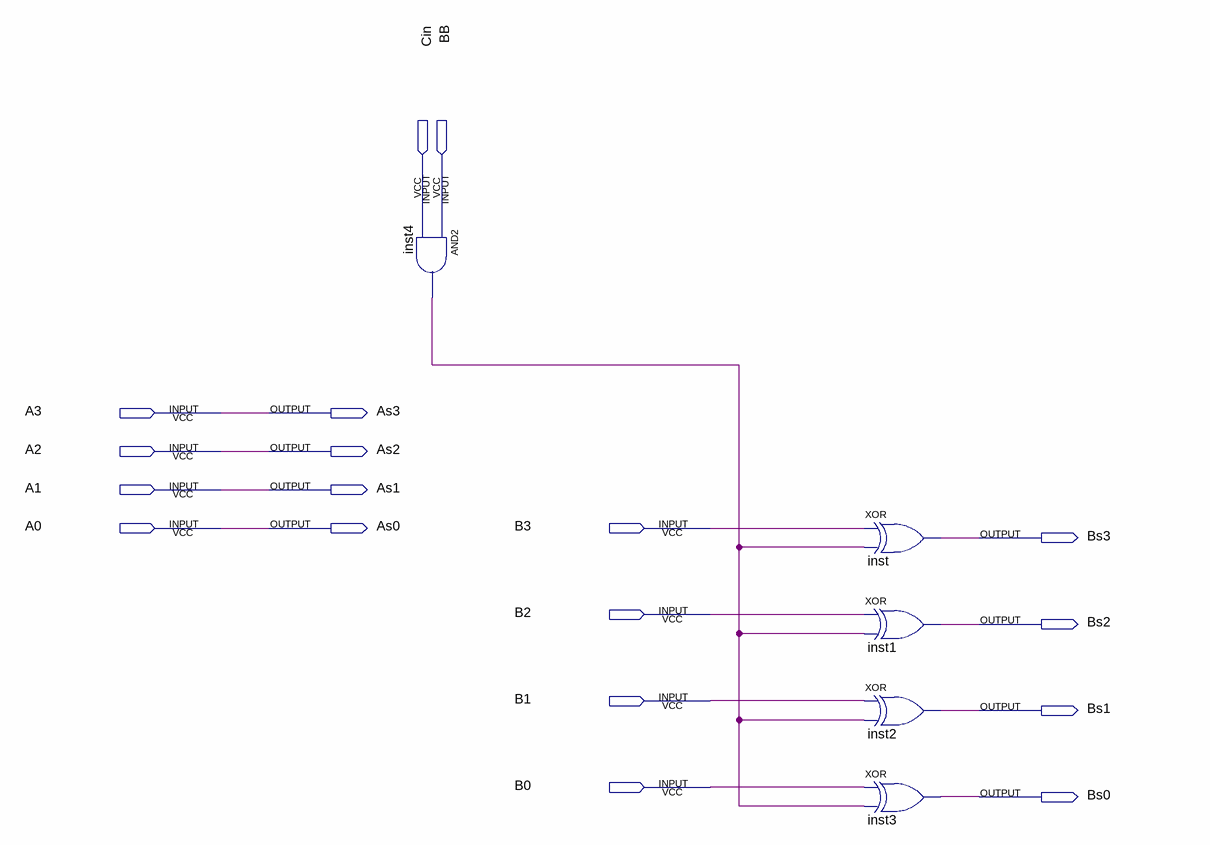
[diagram p0: schematic sheet]
// Quartus schematic SelectSumSub.bdf as structural Verilog: 5 symbols, 18 pins
module SelectSumSub (
  input  Cin,
  input  BB,
  input  A3,
  input  A2,
  input  A1,
  input  A0,
  input  B3,
  input  B2,
  input  B1,
  input  B0,
  output As3,
  output As2,
  output As1,
  output As0,
  output Bs3,
  output Bs2,
  output Bs1,
  output Bs0
);

  wire inst4_out;

  and inst4 (inst4_out, BB, Cin);
  xor inst (Bs3, B3, inst4_out);
  xor inst1 (Bs2, B2, inst4_out);
  xor inst2 (Bs1, B1, inst4_out);
  xor inst3 (Bs0, B0, inst4_out);

  assign As0 = A0;
  assign As1 = A1;
  assign As2 = A2;
  assign As3 = A3;
endmodule
